# Altium schematic sheet BLM_2017.SchDoc: BLM_2017
size A4; Organization: UBC Formula Electric; Revision: A; SheetNumber: 1; SheetTotal: 1; DocumentName: BLM_2017; ProjectName: BLM_2017
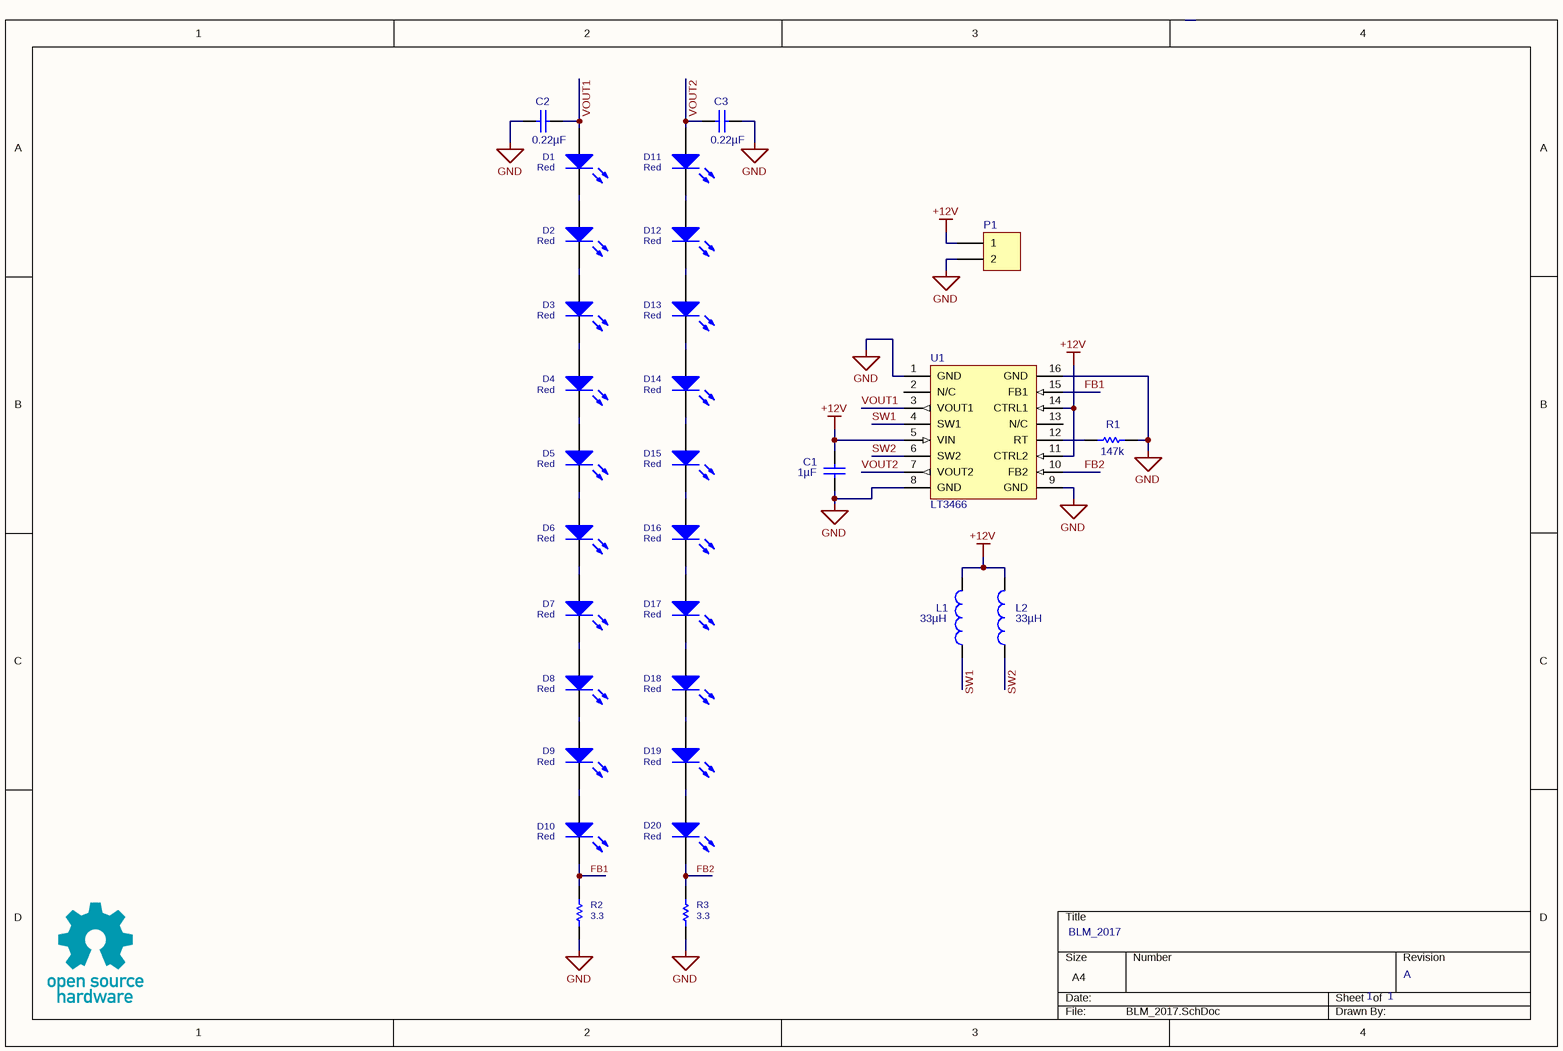
[diagram p0: BLM_2017.SchDoc]

## Parts
C1  value 1µF  [TDK C-Series (2012)]  (hidden comment: Cap Semi)
C2  value 0.22µF  [TDK C-Series (1608)]  (hidden comment: Cap Semi)
C3  value 0.22µF  [TDK C-Series (1608)]  (hidden comment: Cap Semi)
D1  Red  [OPTEK OVS5MxBCR4-Series (2-SMD)]
D2  Red  [OPTEK OVS5MxBCR4-Series (2-SMD)]
D3  Red  [OPTEK OVS5MxBCR4-Series (2-SMD)]
D4  Red  [OPTEK OVS5MxBCR4-Series (2-SMD)]
D5  Red  [OPTEK OVS5MxBCR4-Series (2-SMD)]
D6  Red  [OPTEK OVS5MxBCR4-Series (2-SMD)]
D7  Red  [OPTEK OVS5MxBCR4-Series (2-SMD)]
D8  Red  [OPTEK OVS5MxBCR4-Series (2-SMD)]
D9  Red  [OPTEK OVS5MxBCR4-Series (2-SMD)]
D10  Red  [OPTEK OVS5MxBCR4-Series (2-SMD)]
D11  Red  [OPTEK OVS5MxBCR4-Series (2-SMD)]
D12  Red  [OPTEK OVS5MxBCR4-Series (2-SMD)]
D13  Red  [OPTEK OVS5MxBCR4-Series (2-SMD)]
D14  Red  [OPTEK OVS5MxBCR4-Series (2-SMD)]
D15  Red  [OPTEK OVS5MxBCR4-Series (2-SMD)]
D16  Red  [OPTEK OVS5MxBCR4-Series (2-SMD)]
D17  Red  [OPTEK OVS5MxBCR4-Series (2-SMD)]
D18  Red  [OPTEK OVS5MxBCR4-Series (2-SMD)]
D19  Red  [OPTEK OVS5MxBCR4-Series (2-SMD)]
D20  Red  [OPTEK OVS5MxBCR4-Series (2-SMD)]
L1  value 33µH  [Bourns SRN4018-Series]  (hidden comment: Inductor)
L2  value 33µH  [Bourns SRN4018-Series]  (hidden comment: Inductor)
P1  2-Pin Bare Wire Pads  [2-Pin Bare Wire Pads]  (value not drawn)
R1  value 147k  [Panasonic ERJ-Series (1608)]  (hidden comment: Res1)
R2  value 3.3  [Panasonic ERJ-Series (1608)]  (hidden comment: Res1)
R3  value 3.3  [Panasonic ERJ-Series (1608)]  (hidden comment: Res1)
U1  LT3466  [Linear Technology LT3466 (16-TSSOP)]

## Nets
+12V: C1.2 L1.2 L2.2 P1.1 U1.5(VIN) U1.11(CTRL2) U1.14(CTRL1)
GND: C1.1 C2.2 C3.1 P1.2 R1.1 R2.1 R3.1 U1.1(GND) U1.8(GND) U1.9(GND) U1.16(GND)
FB1: D10.2(K) R2.2 U1.15(FB1)
FB2: D20.2(K) R3.2 U1.10(FB2)
SW1: L1.1 U1.4(SW1)
SW2: L2.1 U1.6(SW2)
VOUT1: C2.1 D1.1(A) U1.3(VOUT1)
VOUT2: C3.2 D11.1(A) U1.7(VOUT2)
NetD1_2: D1.2(K) D2.1(A)
NetD2_2: D2.2(K) D3.1(A)
NetD3_2: D3.2(K) D4.1(A)
NetD4_2: D4.2(K) D5.1(A)
NetD5_2: D5.2(K) D6.1(A)
NetD6_2: D6.2(K) D7.1(A)
NetD7_2: D7.2(K) D8.1(A)
NetD8_2: D8.2(K) D9.1(A)
NetD9_2: D9.2(K) D10.1(A)
NetD11_2: D11.2(K) D12.1(A)
NetD12_2: D12.2(K) D13.1(A)
NetD13_2: D13.2(K) D14.1(A)
NetD14_2: D14.2(K) D15.1(A)
NetD15_2: D15.2(K) D16.1(A)
NetD16_2: D16.2(K) D17.1(A)
NetD17_2: D17.2(K) D18.1(A)
NetD18_2: D18.2(K) D19.1(A)
NetD19_2: D19.2(K) D20.1(A)
NetR1_2: R1.2 U1.12(RT)

Not connected (* = marked no-connect by the designer): U1 2(N/C) 13(N/C)

## Library data of the parts
C1-C3 = Cap Semi: Capacitor (Semiconductor SIM Model); Published: 8-Jun-2000; LatestRevisionDate: 29-May-2009; LatestRevisionNote: IPC-7351 Footprint Added.; PackageReference: C1206; Publisher: Altium Limited; PackageDescription: Chip Capacitor; Supplier 1: Digi-Key
  C1: Supplier Part Number 1: 445-14539-1-ND
  C2 C3: Supplier Part Number 1: 445-7408-1-ND
D1-D20 = LED0: Typical INFRARED GaAs LED; Published: 8-Jun-2000; LatestRevisionDate: 08-Jul-2005; LatestRevisionNote: Mech Layer 1 removed.; PackageReference: LED-0; Publisher: Altium Limited; PackageDescription: LED; 2 Leads; Supplier 1: Digi-Key; Supplier Part Number 1: 365-1546-1-ND
L1 L2 = Inductor: Code_IEC: 1005; Published: 8-Jun-2000; LatestRevisionDate: 29-May-2009; LatestRevisionNote: IPC-7351 Footprint Added.; PackageReference: 0402-A; Publisher: Altium Limited; PackageDescription: Chip Inductor; Code_JEITA: 0402; Supplier 1: Digi-Key; Supplier Part Number 1: SRN4018-330MCT-ND
R1-R3 = Res1: Resistor; Published: 8-Jun-2000; LatestRevisionDate: 17-Jul-2002; LatestRevisionNote: Re-released for DXP Platform.; PackageReference: AXIAL-0.3; Publisher: Altium Limited; PackageDescription: Axial Device, Thru-Hole; 2 Leads; 0.3 in Pin Spacing; Supplier 1: Digi-Key
  R1: Supplier Part Number 1: P147KHCT-ND
  R2 R3: Supplier Part Number 1: P3.3AJCT-ND
U1 = Linear Technology LT3466: 2-Channel Step-Up LED Driver; Supplier 1: Digi-Key; Supplier Part Number 1: LT3466EFE#PBF-ND